# EAGLE schematic WiFiRadio (EAGLE 8.0.1)
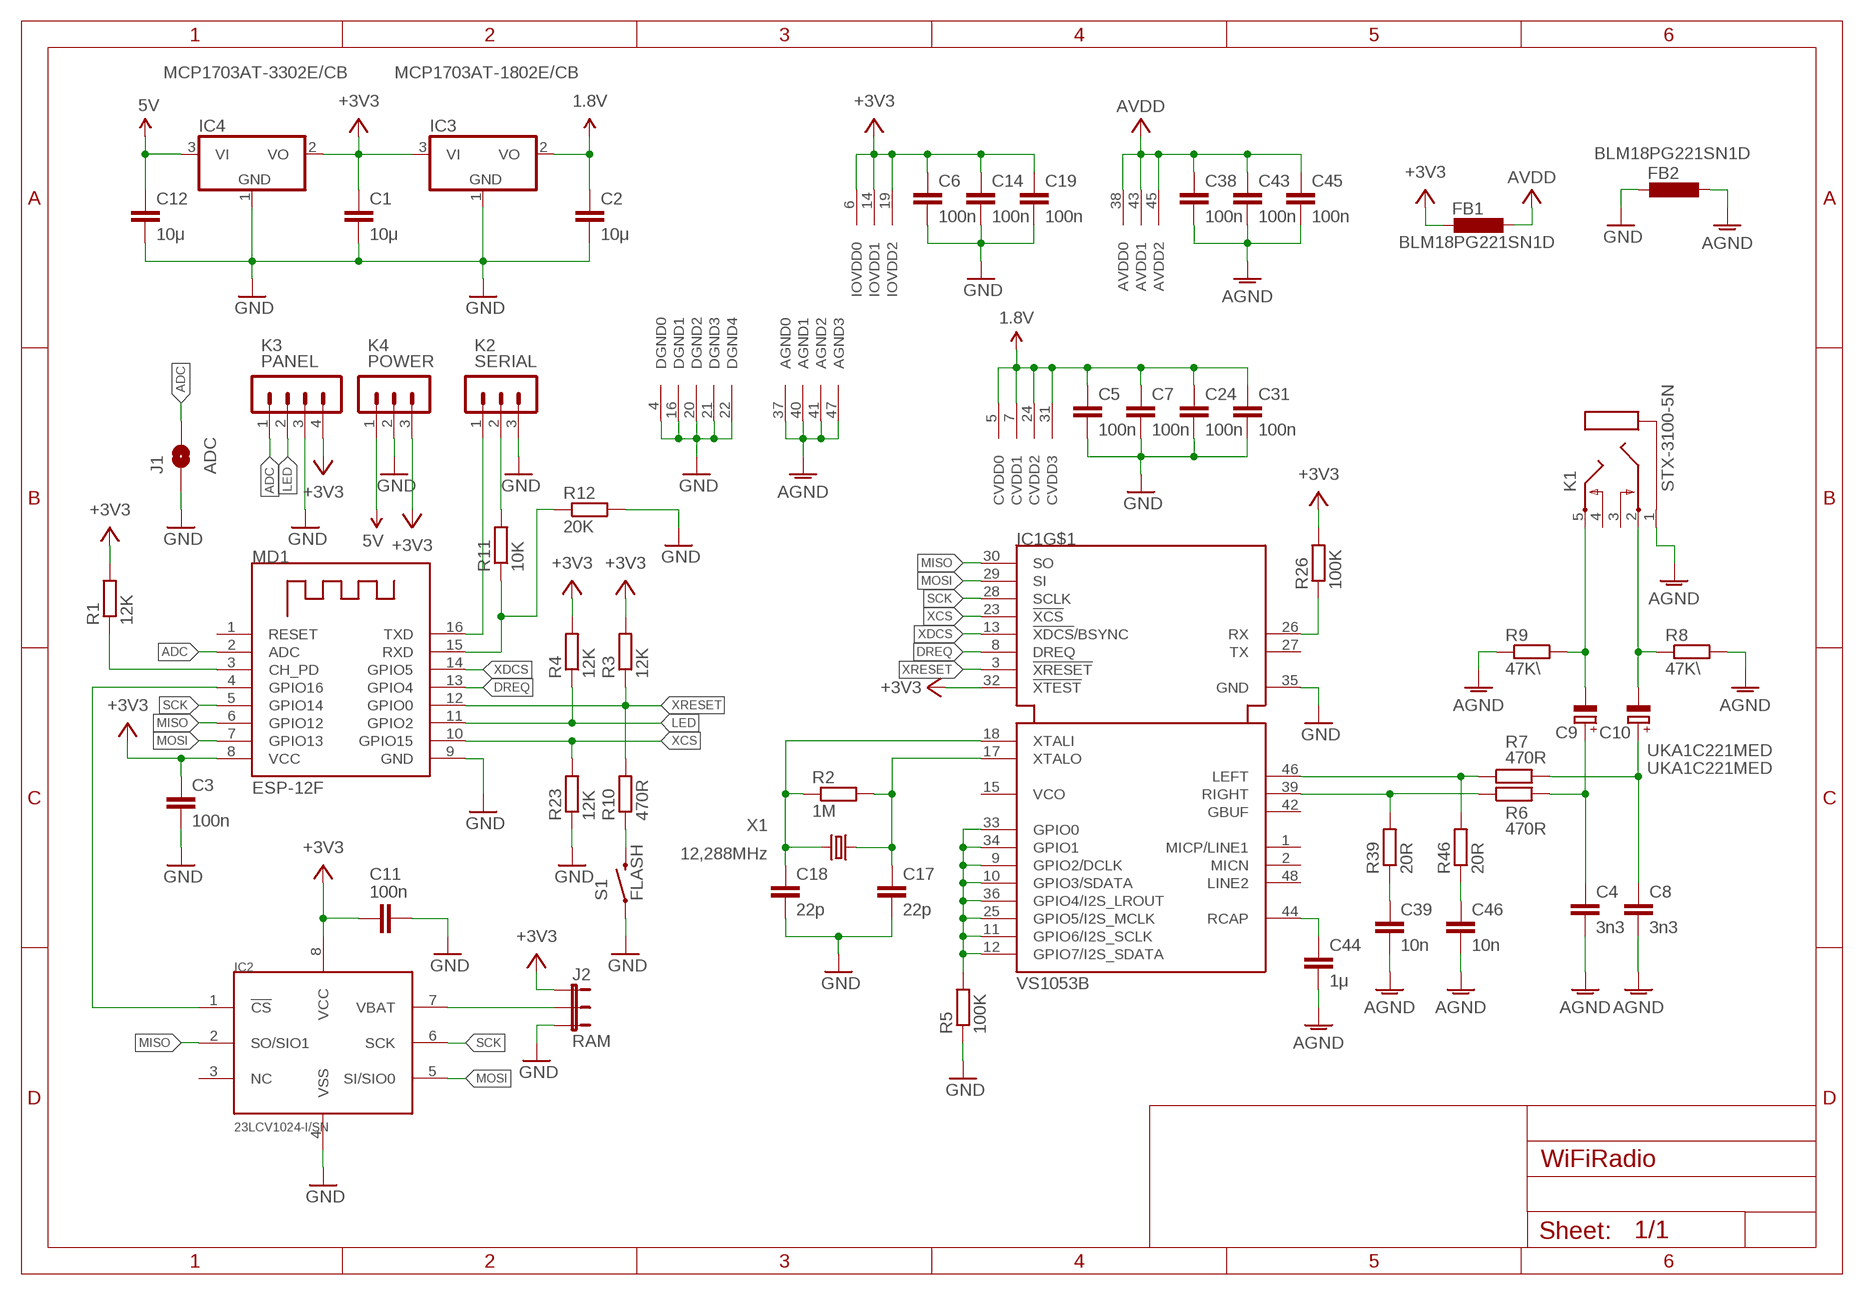
[diagram p0: schematic, sheet 1]

## Parts
C1  10μ  C-EUC0805  [C0805]
C2  10μ  C-EUC0805  [C0805]
C3  100n  C-EUC0603  [C0603]
C4  3n3  C-EUC0805  [C0805]
C5  100n  C-EUC0603  [C0603]
C6  100n  C-EUC0603  [C0603]
C7  100n  C-EUC0603  [C0603]
C8  3n3  C-EUC0805  [C0805]
C9  UKA1C221MED  CPOL-EUE2.5-7  [E2,5-7]
C10  UKA1C221MED  CPOL-EUE2.5-7  [E2,5-7]
C11  100n  C-EUC0603  [C0603]
C12  10μ  C-EUC0805  [C0805]
C14  100n  C-EUC0603  [C0603]
C17  22p  C-EUC0805  [C0805]
C18  22p  C-EUC0805  [C0805]
C19  100n  C-EUC0603  [C0603]
C24  100n  C-EUC0603  [C0603]
C31  100n  C-EUC0603  [C0603]
C38  100n  C-EUC0603  [C0603]
C39  10n  C-EUC0805  [C0805]
C43  100n  C-EUC0603  [C0603]
C44  1μ  C-EUC0805  [C0805]
C45  100n  C-EUC0603  [C0603]
C46  10n  C-EUC0805  [C0805]
FB1  BLM18PG221SN1D  L-EUL2012C  [L2012C]
FB2  BLM18PG221SN1D  L-EUL2012C  [L2012C]
IC1  VS1053B  [LQFP48]
IC2  23LCV1024-I/SN  [SO-08]
IC3  MCP1703AT-1802E/CB  MCP1703CB  [SOT23]
IC4  MCP1703AT-3302E/CB  MCP1703CB  [SOT23]
J1  ADC  SOLDERJUMPER-OLDNC  [SJ_2S]
J2  RAM  JUMPER-3SMD  [SJ_3]
K1  STX-3100-5N  STEREOJACK  [STX3100]
K2  SERIAL  MA03-1  [MA03-1]
K3  PANEL  MA04-1  [MA04-1]
K4  POWER  MA03-1  [MA03-1]
MD1  ESP-12F  [ESP-12F]
R1  12K  R-EU_R0805  [R0805]
R2  1M  R-EU_R0805  [R0805]
R3  12K  R-EU_R0805  [R0805]
R4  12K  R-EU_R0805  [R0805]
R5  100K  R-EU_R0805  [R0805]
R6  470R  R-EU_R0805  [R0805]
R7  470R  R-EU_R0805  [R0805]
R8  47K\  R-EU_R0805  [R0805]
R9  47K\  R-EU_R0805  [R0805]
R10  470R  R-EU_R0805  [R0805]
R11  10K  R-EU_R0603  [R0603]
R12  20K  R-EU_R0603  [R0603]
R23  12K  R-EU_R0805  [R0805]
R26  100K  R-EU_R0805  [R0805]
R39  20R  R-EU_R0805  [R0805]
R46  20R  R-EU_R0805  [R0805]
S1  FLASH  SWITCH-MOMENTARY-2SMD  [TACTILE-SWITCH-SMD]
X1  12,288MHz  CRYSTALHC49S  [HC49/S]

## Nets
1.8V: C2.1 C5.1 C7.1 C24.1 C31.1 IC1.5(CVDD0) IC1.7(CVDD1) IC1.24(CVDD2) IC1.31(CVDD3) IC3.2(VO)
5V: C12.1 IC4.3(VI) K4.1
+3V3: C1.1 C3.1 C6.1 C11.1 C14.1 C19.1 FB1.2 IC1.6(IOVDD0) IC1.14(IOVDD1) IC1.19(IOVDD2) IC1.32(!XTEST) IC2.8(VCC) IC3.3(VI) IC4.2(VO) J2.1 K3.4 K4.3 MD1.8(VCC) R1.2 R3.2 R4.2 R26.2
ADC: J1.2 K3.1 MD1.2(ADC)
AGND: C4.2 C8.2 C38.2 C39.2 C43.2 C44.2 C45.2 C46.2 FB2.1 IC1.37(AGND0) IC1.40(AGND1) IC1.41(AGND2) IC1.47(AGND3) K1.1 R8.2 R9.1
DREQ: IC1.8(DREQ) MD1.13(GPIO4)
GND: C1.2 C2.2 C3.2 C5.2 C6.2 C7.2 C11.2 C12.2 C14.2 C17.2 C18.2 C19.2 C24.2 C31.2 FB2.2 IC1.4(DGND0) IC1.16(DGND1) IC1.20(DGND2) IC1.21(DGND3) IC1.22(DGND4) IC1.35(GND) IC2.4(VSS) IC3.1(GND) IC4.1(GND) J1.1 J2.3 K2.3 K3.3 K4.2 MD1.9(GND) R5.1 R12.2 R23.1 S1.1
GPIO: IC1.9(GPIO2/DCLK) IC1.10(GPIO3/SDATA) IC1.11(GPIO6/I2S_SCLK) IC1.12(GPIO7/I2S_SDATA) IC1.25(GPIO5/I2S_MCLK) IC1.33(GPIO0) IC1.34(GPIO1) IC1.36(GPIO4/I2S_LROUT) R5.2
LED: K3.2 MD1.11(GPIO2) R4.1
LEFT: IC1.46(LEFT) R7.1 R46.2
MISO: IC1.30(SO) IC2.2(SO/SIO1) MD1.6(GPIO12)
MOSI: IC1.29(SI) IC2.5(SI/SIO0) MD1.7(GPIO13)
N$1: IC2.1(!CS) MD1.4(GPIO16)
N$2: MD1.3(CH_PD) R1.1
N$4: C17.1 IC1.17(XTALO) R2.2 X1.1
N$5: C18.1 IC1.18(XTALI) R2.1 X1.2
N$6: K2.2 R11.2
N$7: C4.1 C9.+ R6.2
N$8: C8.1 C10.+ R7.2
N$9: IC2.7(VBAT) J2.2
N$10: C39.1 R39.1
N$11: C46.1 R46.1
N$14: C9.- K1.5 R9.2
N$15: C10.- K1.2 R8.1
N$18: R10.1 S1.3
RCAP: C44.1 IC1.44(RCAP)
RIGHT: IC1.39(RIGHT) R6.1 R39.2
RX: IC1.26(RX) R26.1
RXD: MD1.15(RXD) R11.1 R12.1
SCK: IC1.28(SCLK) IC2.6(SCK) MD1.5(GPIO14)
TXD: K2.1 MD1.16(TXD)
V+: C38.1 C43.1 C45.1 FB1.1 IC1.38(AVDD0) IC1.43(AVDD1) IC1.45(AVDD2) ; supply symbol labelled AVDD
XCS: IC1.23(!XCS) MD1.10(GPIO15) R23.2
XDCS: IC1.13(!XDCS!/BSYNC) MD1.14(GPIO5)
XRESET: IC1.3(!XRESET) MD1.12(GPIO0) R3.1 R10.2
Unconnected: IC1.1(MICP/LINE1) IC1.2(MICN) IC1.15(VCO) IC1.27(TX) IC1.42(GBUF) IC1.48(LINE2) IC2.3(NC) K1.3 K1.4 MD1.1(RESET)

## Library data of the parts
C1-C8 C11 C12 C14 C17-C19 C24 C31 C38 C39 C43-C46 = rcl:C-EU: CAPACITOR, European symbol
C9 C10 = rcl:CPOL-EU: POLARIZED CAPACITOR, European symbol
FB1 FB2 = rcl:L-EU: INDUCTOR, European symbol
IC1 = VS1053b:VS1053B: VS1053b VS1053b is an Ogg Vorbis/MP3/AAC/WMA/ FLAC/WAVMIDI audio decoder as well as an PCM/IMA ADPCM/Ogg Vorbis encoder on a single chip. It contains a high-performance, proprietary low-power DSP processor core VS_DSP4, data memory, 16 KiB instruction RAM and 0.5+ KiB data RAM for user appli- cationsrunningsimultaneouslywithanybuilt- in decoder, serial control and input data in- terfaces, upto 8 general purpose I/O pins, an UART, as well as a high-quality variable-sample- rate stereo ADC (mic, line, line + mic or 2×line) and stereo DAC, followed by an earphone am- plifier and a common voltage buffer.
IC2 = 23LCV1024:23LCV1024: 1 Mbit SPI Serial SRAM with Battery Backup and SDI Interface
IC3 IC4 = linear:MCP1703: 250 mA, 16V, Low Quiescent Current LDO Regulator Source: http://ww1.microchip.com/downloads/en/DeviceDoc/22049b.pdf
J1 = SparkFun-Retired:SOLDERJUMPER-OLD: Solder Jumper Standard SMD solder jumper. Used to automate production. Two varients : Normally Open and Normally Closed are the same, but have different paste layers. NC will have a large amount of paste and should jumper during reflow.
J2 = SparkFun-Retired:JUMPER-3
K1 = adafruit:STEREOJACK: MIC/HEADPHONE JACK Stereo jack with two switches. Kycon STX3100, CUI SJ1-3555NG and/or 4UCon 05544
K2 K4 = con-lstb:MA03-1: PIN HEADER; OC_FARNELL: unknown; OC_NEWARK: unknown
K3 = con-lstb:MA04-1: PIN HEADER; OC_FARNELL: unknown; OC_NEWARK: unknown
MD1 = ESP-12F:ESP-12F
R1-R12 R23 R26 R39 R46 = rcl:R-EU_: RESISTOR, European symbol
S1 = SparkFun-Electromechanical:SWITCH-MOMENTARY-2: Various NO switches- pushbuttons, reed, etc; PROD_ID: SWCH-08247
X1 = crystal:CRYSTAL: CRYSTAL; OC_FARNELL: 1667008; OC_NEWARK: unknown